# EasyEDA schematic 1-Schematic_Gripper_diplomski.json
REV: 1.0; Date: 2025-11-20; Sheet: 1/1; Drawn By: Dušan Grković RA56-2021; Company: Fakultet tehničkih nauka, Novi Sad
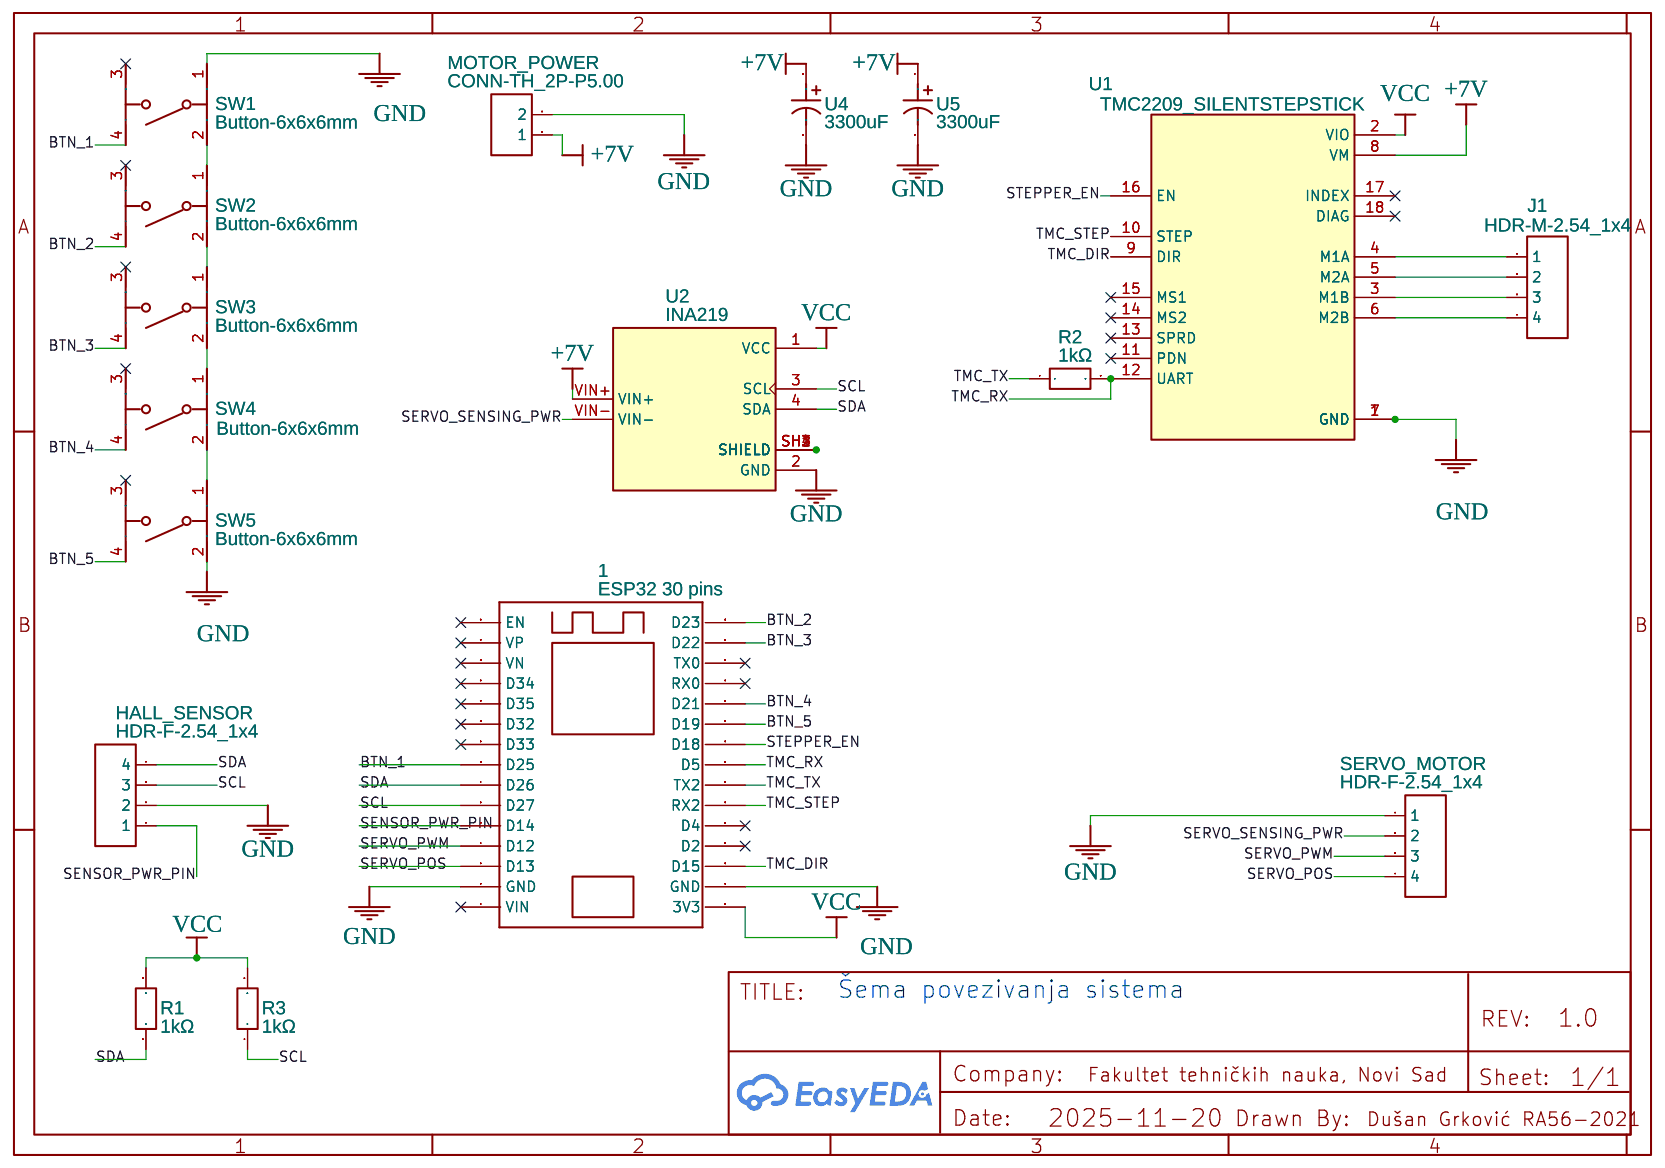
[diagram p0: schematic sheet]

## Parts
1  ESP32 30 pins  [ESP32 DEVKIT 30 PINS]
HALL_SENSOR  HDR-F-2.54_1x4  [HDR-F-2.54_1X4]
J1  HDR-M-2.54_1x4  [HDR-M-2.54_1X4]
MOTOR_POWER  CONN-TH_2P-P5.00  [CONN-TH_2P-P5.00]
R1  1kΩ  [RES-TH_BD2.4-L6.3-P10.30-D0.6]
R2  1kΩ  [RES-TH_BD2.4-L6.3-P10.30-D0.6]
R3  1kΩ  [RES-TH_BD2.4-L6.3-P10.30-D0.6]
SERVO_MOTOR  HDR-F-2.54_1x4  [HDR-F-2.54_1X4]
SW1  Button-6x6x6mm  [SW-TH_4P-L6.0-W6.0-P4.50-LS6.1]
SW2  Button-6x6x6mm  [SW-TH_4P-L6.0-W6.0-P4.50-LS6.1]
SW3  Button-6x6x6mm  [SW-TH_4P-L6.0-W6.0-P4.50-LS6.1]
SW4  Button-6x6x6mm  [SW-TH_4P-L6.0-W6.0-P4.50-LS6.1]
SW5  Button-6x6x6mm  [SW-TH_4P-L6.0-W6.0-P4.50-LS6.1]
U1  TMC2209_SILENTSTEPSTICK  [MODULE_TMC2209_SILENTSTEPSTICK]
U2  INA219  [MODULE_INA219]
U4  3300uF  [CAP-TH_BD12.5-P5.00-D0.8-FD]
U5  3300uF  [CAP-TH_BD12.5-P5.00-D0.8-FD]

## Library data of the parts
1 = ESP32 30 pins: Contributor: dusangrkovic2002
HALL_SENSOR SERVO_MOTOR = HDR-F-2.54_1x4: Supplier Part: C225501; Supplier: LCSC; Contributor: LCEDA_Lib
J1 = HDR-M-2.54_1x4: Supplier Part: C124378; Supplier: LCSC; Contributor: LCEDA_Lib
MOTOR_POWER = CONN-TH_2P-P5.00: Supplier: LCSC; Contributor: LCEDA_Lib
R1-R3 = MF0207FTE52-1K: Contributor: lcsc; Supplier: LCSC; Supplier Part: C513706; Manufacturer: YAGEO(国巨); JLCPCB Part Class: Extended Part
SW1-SW5 = Button-6x6x6mm: Supplier Part: C71836; Supplier: LCSC; Manufacturer: BBJ; Manufacturer Part: Switch,6*6*6Plastic head,260G, 0.25mm,Straight line
U1 = TMC2209_SILENTSTEPSTICK: Manufacturer: Trinamic Motion Control GmbH; Contributor: dusangrkovic2002
U2 = INA219: Manufacturer: Adafruit Industries LLC; Contributor: dusangrkovic2002
U4 U5 = 16PX3300MEFC12.5X20: Contributor: lcsc; Supplier: LCSC; Supplier Part: C5114465; Manufacturer: rubycon(红宝石)

## Nets
+7V: MOTOR_POWER.1 U1.8(VM) U2.VIN+ U4.1 U5.1
GND: 1.2(GND) 1.17(GND) HALL_SENSOR.2 MOTOR_POWER.2 SERVO_MOTOR.1 SW1.1 SW5.2 U1.1(GND) U1.7(GND) U2.2(GND) U4.2 U5.2
VCC: 1.16(3V3) R1.2 R3.2 U1.2(VIO) U2.1(VCC)
BTN_1: 1.8(D25) SW1.4
BTN_2: 1.30(D23) SW2.4
BTN_3: 1.29(D22) SW3.4
BTN_4: 1.26(D21) SW4.4
BTN_5: 1.25(D19) SW5.4
SCL: 1.6(D27) HALL_SENSOR.3 R3.1 U2.3(SCL)
SDA: 1.7(D26) HALL_SENSOR.4 R1.1 U2.4(SDA)
SENSOR_PWR_PIN: 1.5(D14) HALL_SENSOR.1
SERVO_POS: 1.3(D13) SERVO_MOTOR.4
SERVO_PWM: 1.4(D12) SERVO_MOTOR.3
SERVO_SENSING_PWR: SERVO_MOTOR.2 U2.VIN-
STEPPER_EN: 1.24(D18) U1.16(EN)
TMC_DIR: 1.18(D15) U1.9(DIR)
TMC_RX: 1.23(D5) R2.2 U1.12(UART)
TMC_STEP: 1.21(RX2) U1.10(STEP)
TMC_TX: 1.22(TX2) R2.1
Net-(J1-1): J1.1 U1.4(M1A)
Net-(J1-2): J1.2 U1.5(M2A)
Net-(J1-3): J1.3 U1.3(M1B)
Net-(J1-4): J1.4 U1.6(M2B)
Net-(SW1-2): SW1.2 SW2.1
Net-(SW2-2): SW2.2 SW3.1
Net-(SW3-2): SW3.2 SW4.1
Net-(SW4-2): SW4.2 SW5.1
Net-(U2-SH1): U2.SH1(SHIELD) U2.SH2(SHIELD) U2.SH3(SHIELD) U2.SH4(SHIELD)

Not connected (* = marked no-connect by the designer): 1 1(VIN)* 9(D33)* 10(D32)* 11(D35)* 12(D34)* 13(VN)* 14(VP)* 15(EN)* 19(D2)* 20(D4)* 27(RX0)* 28(TX0)*; SW1 3*; SW2 3*; SW3 3*; SW4 3*; SW5 3*; U1 11(PDN)* 13(SPRD)* 14(MS2)* 15(MS1)* 17(INDEX)* 18(DIAG)*

## Notes on the sheet
- Šema povezivanja sistema
